# Altium schematic sheet 13_LMS3_Power.SchDoc: LMS7002M power supply (LMS3)
size A3; Organization: Lime Microsystems; Address1: Surrey Tech Centre; Address2: Guildford GU2 7YG; Address3: Surrey; Address4: United Kingdom; SheetNumber: 10
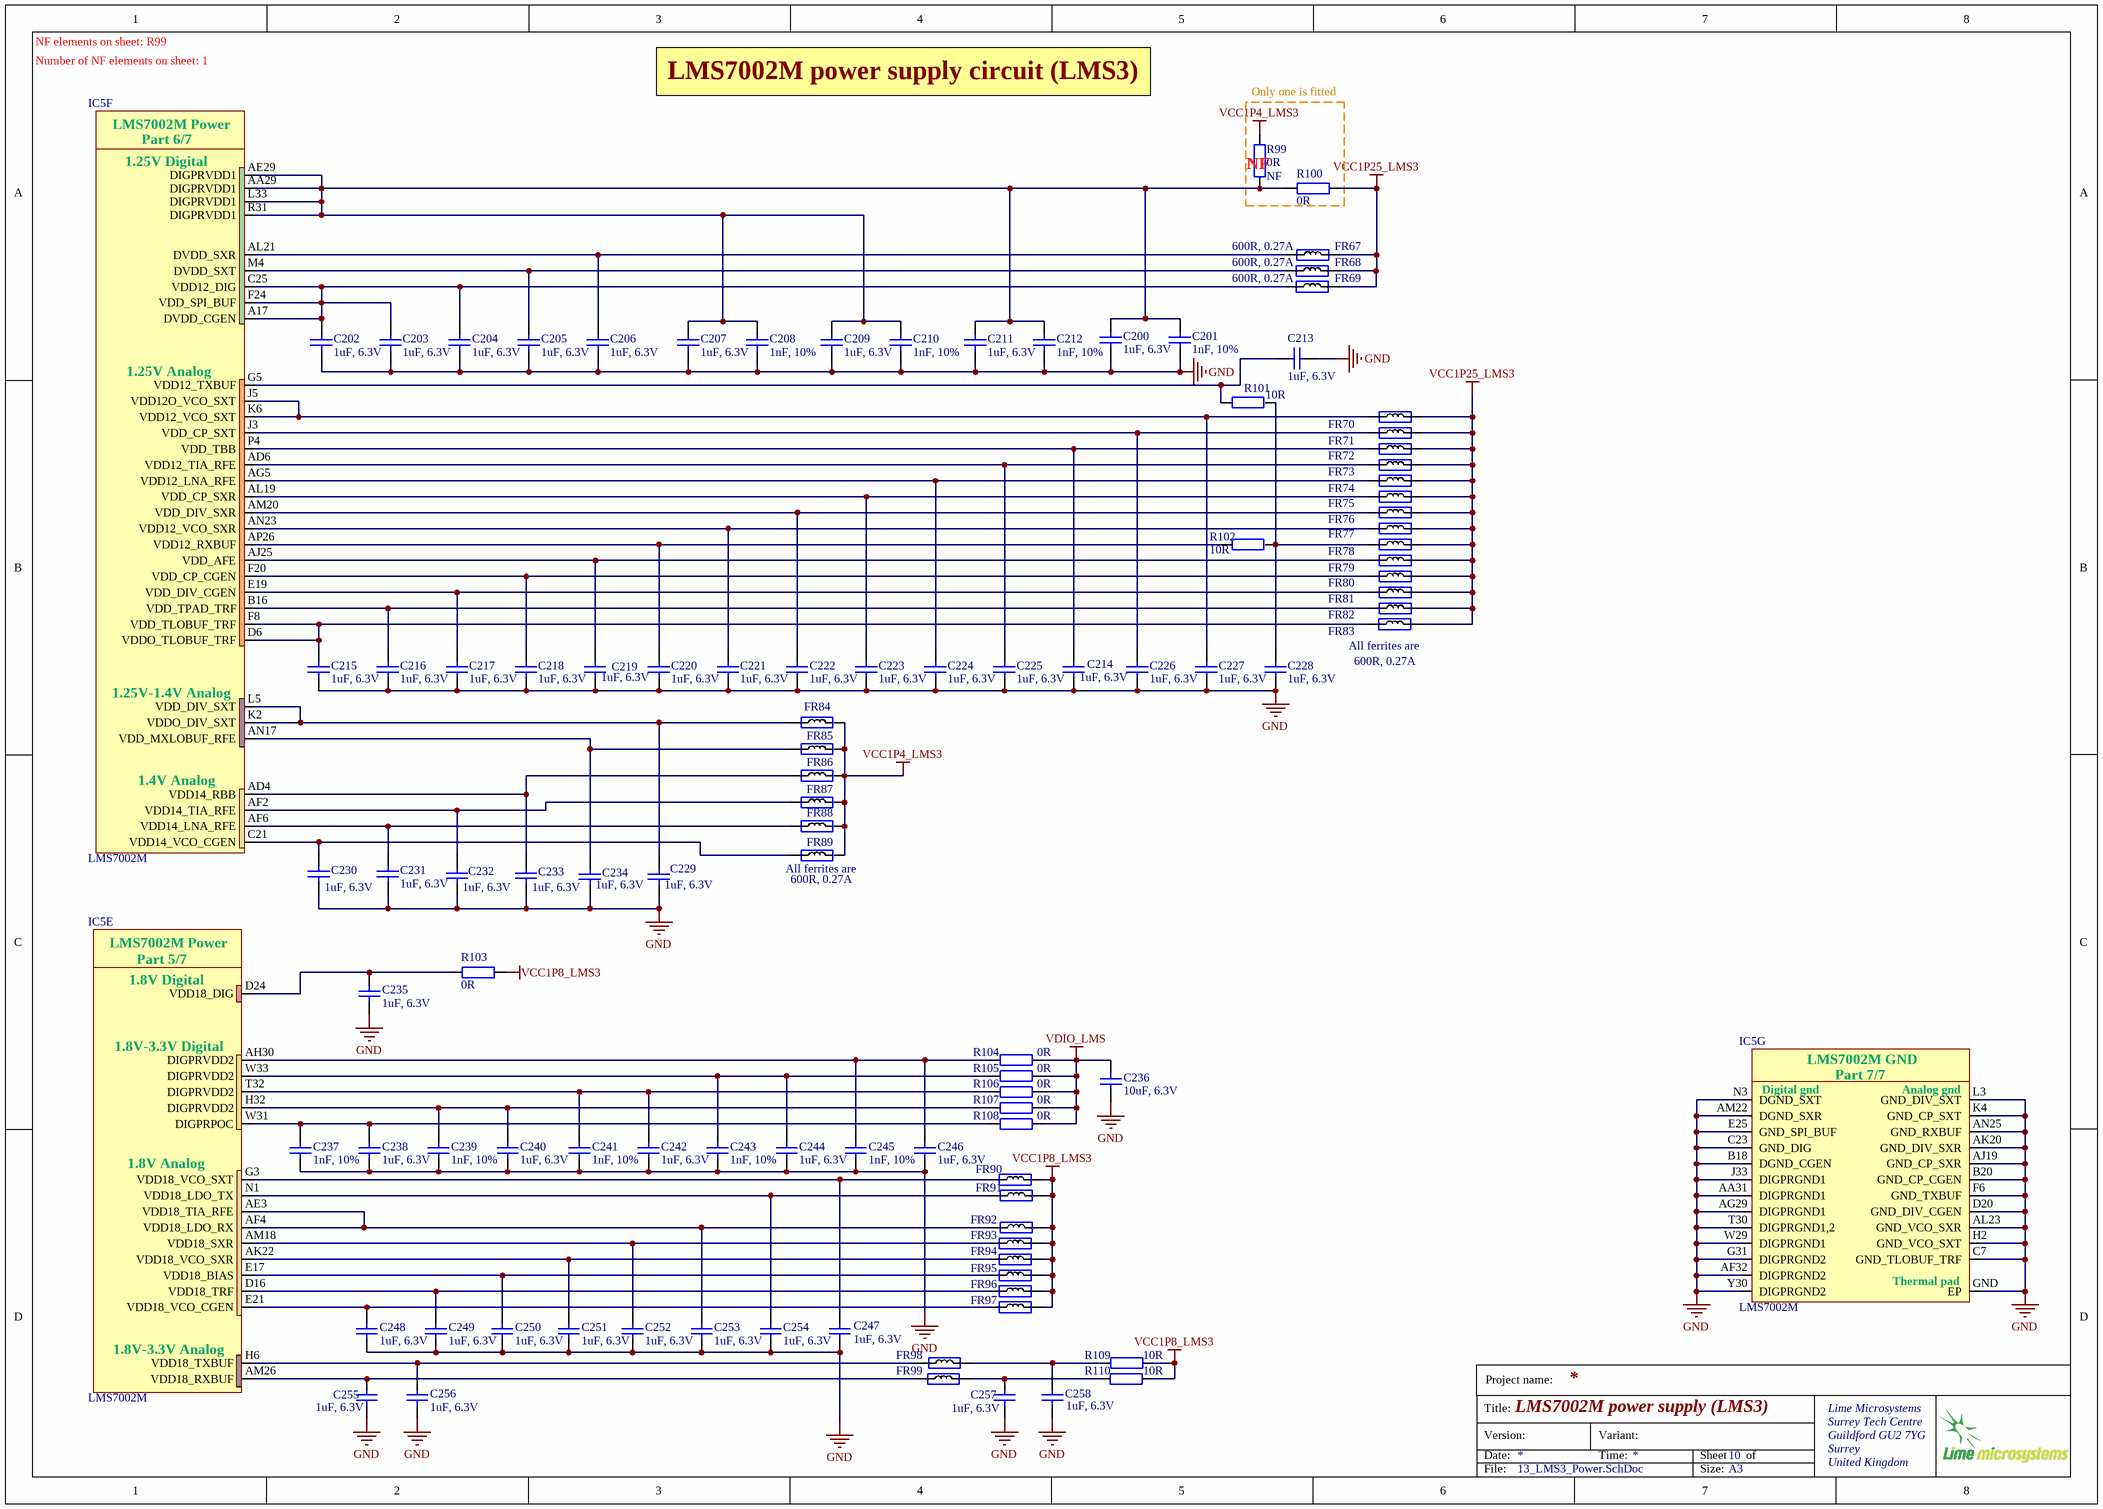
[diagram p0: 13_LMS3_Power.SchDoc]

## Parts
C200  1uF, 6.3V  [CAP0201]
C201  1nF, 10%  [CAP0201]
C202  1uF, 6.3V  [CAP0201]
C203  1uF, 6.3V  [CAP0201]
C204  1uF, 6.3V  [CAP0201]
C205  1uF, 6.3V  [CAP0201]
C206  1uF, 6.3V  [CAP0201]
C207  1uF, 6.3V  [CAP0201]
C208  1nF, 10%  [CAP0201]
C209  1uF, 6.3V  [CAP0201]
C210  1nF, 10%  [CAP0201]
C211  1uF, 6.3V  [CAP0201]
C212  1nF, 10%  [CAP0201]
C213  1uF, 6.3V  [CAP0201]
C214  1uF, 6.3V  [CAP0201]
C215  1uF, 6.3V  [CAP0201]
C216  1uF, 6.3V  [CAP0201]
C217  1uF, 6.3V  [CAP0201]
C218  1uF, 6.3V  [CAP0201]
C219  1uF, 6.3V  [CAP0201]
C220  1uF, 6.3V  [CAP0201]
C221  1uF, 6.3V  [CAP0201]
C222  1uF, 6.3V  [CAP0201]
C223  1uF, 6.3V  [CAP0201]
C224  1uF, 6.3V  [CAP0201]
C225  1uF, 6.3V  [CAP0201]
C226  1uF, 6.3V  [CAP0201]
C227  1uF, 6.3V  [CAP0201]
C228  1uF, 6.3V  [CAP0201]
C229  1uF, 6.3V  [CAP0201]
C230  1uF, 6.3V  [CAP0201]
C231  1uF, 6.3V  [CAP0201]
C232  1uF, 6.3V  [CAP0201]
C233  1uF, 6.3V  [CAP0201]
C234  1uF, 6.3V  [CAP0201]
C235  1uF, 6.3V  [CAP0201]
C236  10uF, 6.3V  [CAP0603]
C237  1nF, 10%  [CAP0201]
C238  1uF, 6.3V  [CAP0201]
C239  1nF, 10%  [CAP0201]
C240  1uF, 6.3V  [CAP0201]
C241  1nF, 10%  [CAP0201]
C242  1uF, 6.3V  [CAP0201]
C243  1nF, 10%  [CAP0201]
C244  1uF, 6.3V  [CAP0201]
C245  1nF, 10%  [CAP0201]
C246  1uF, 6.3V  [CAP0201]
C247  1uF, 6.3V  [CAP0201]
C248  1uF, 6.3V  [CAP0201]
C249  1uF, 6.3V  [CAP0201]
C250  1uF, 6.3V  [CAP0201]
C251  1uF, 6.3V  [CAP0201]
C252  1uF, 6.3V  [CAP0201]
C253  1uF, 6.3V  [CAP0201]
C254  1uF, 6.3V  [CAP0201]
C255  1uF, 6.3V  [CAP0201]
C256  1uF, 6.3V  [CAP0201]
C257  1uF, 6.3V  [CAP0201]
C258  1uF, 6.3V  [CAP0201]
FR67  600R, 0.27A  [RES0201]
FR68  600R, 0.27A  [RES0201]
FR69  600R, 0.27A  [RES0201]
FR70  600R, 0.27A  [RES0201]  (value not drawn)
FR71  600R, 0.27A  [RES0201]  (value not drawn)
FR72  600R, 0.27A  [RES0201]  (value not drawn)
FR73  600R, 0.27A  [RES0201]  (value not drawn)
FR74  600R, 0.27A  [RES0201]  (value not drawn)
FR75  600R, 0.27A  [RES0201]  (value not drawn)
FR76  600R, 0.27A  [RES0201]  (value not drawn)
FR77  600R, 0.27A  [RES0201]  (value not drawn)
FR78  600R, 0.27A  [RES0201]  (value not drawn)
FR79  600R, 0.27A  [RES0201]  (value not drawn)
FR80  600R, 0.27A  [RES0201]  (value not drawn)
FR81  600R, 0.27A  [RES0201]  (value not drawn)
FR82  600R, 0.27A  [RES0201]  (value not drawn)
FR83  600R, 0.27A  [RES0201]  (value not drawn)
FR84  600R, 0.27A  [RES0201]  (value not drawn)
FR85  600R, 0.27A  [RES0201]  (value not drawn)
FR86  600R, 0.27A  [RES0201]  (value not drawn)
FR87  600R, 0.27A  [RES0201]  (value not drawn)
FR88  600R, 0.27A  [RES0201]  (value not drawn)
FR89  600R, 0.27A  [RES0201]  (value not drawn)
FR90  600R, 0.27A  [RES0201]  (value not drawn)
FR91  600R, 0.27A  [RES0201]  (value not drawn)
FR92  600R, 0.27A  [RES0201]  (value not drawn)
FR93  600R, 0.27A  [RES0201]  (value not drawn)
FR94  600R, 0.27A  [RES0201]  (value not drawn)
FR95  600R, 0.27A  [RES0201]  (value not drawn)
FR96  600R, 0.27A  [RES0201]  (value not drawn)
FR97  600R, 0.27A  [RES0201]  (value not drawn)
FR98  600R, 0.27A  [RES0201]  (value not drawn)
FR99  600R, 0.27A  [RES0201]  (value not drawn)
IC5  LMS7002M  [LMS7002M_v5]  (parts E,F,G of 7)
R99  0R  Assembly Info: NF  [RES0402]
R100  0R  [RES0402]
R101  10R  [RES0201]
R102  10R  [RES0201]
R103  0R  [RES0201]
R104  0R  [RES0402]
R105  0R  [RES0402]
R106  0R  [RES0402]
R107  0R  [RES0402]
R108  0R  [RES0402]
R109  10R  [RES0201]
R110  10R  [RES0201]

## Blocks framed on the sheet
Only one is fitted: R99 R100

## Nets
GND: C200.2 C201.2 C202.2 C203.2 C204.2 C205.1 C206.2 C207.2 C208.2 C209.2 C210.2 C211.2 C212.2 C213.2 C214.2 C215.2 C216.2 C217.2 C218.1 C219.2 C220.2 C221.2 C222.2 C223.2 C224.2 C225.1 C226.2 C227.1 C228.1 C229.2 C230.2 C231.2 C232.2 C233.2 C234.2 C235.2 C236.1 C237.2 C238.2 C239.2 C240.2 C241.2 C242.2 C243.2 C244.2 C245.2 C246.2 C247.2 C248.2 C249.2 C250.2 C251.2 C252.2 C253.2 C254.2 C255.2 C256.2 C257.2 C258.2 IC5.AA31(DIGPRGND1) IC5.AF32(DIGPRGND2) IC5.AG29(DIGPRGND1) IC5.AJ19(GND_CP_SXR) IC5.AK20(GND_DIV_SXR) IC5.AL23(GND_VCO_SXR) IC5.AM22(DGND_SXR) IC5.AN25(GND_RXBUF) IC5.B18(DGND_CGEN) IC5.B20(GND_CP_CGEN) IC5.C7(GND_TLOBUF_TRF) IC5.C23(GND_DIG) IC5.D20(GND_DIV_CGEN) IC5.E25(GND_SPI_BUF) IC5.F6(GND_TXBUF) IC5.G31(DIGPRGND2) IC5.GND(EP) IC5.H2(GND_VCO_SXT) IC5.J33(DIGPRGND1) IC5.K4(GND_CP_SXT) IC5.L3(GND_DIV_SXT) IC5.N3(DGND_SXT) IC5.T30(DIGPRGND1,2) IC5.W29(DIGPRGND1) IC5.Y30(DIGPRGND2)
VCC1P4_LMS3: FR84.2 FR85.2 FR86.2 FR87.2 FR88.2 FR89.2 R99.1
VCC1P8_LMS3: FR90.2 FR91.1 FR92.1 FR93.2 FR94.2 FR95.2 FR96.2 FR97.2 R103.2 R109.2 R110.1
VCC1P25_LMS3: FR67.2 FR68.2 FR69.2 FR70.2 FR71.2 FR72.2 FR73.2 FR74.2 FR75.2 FR76.2 FR77.2 FR78.2 FR79.2 FR80.2 FR81.2 FR82.2 FR83.2 R100.1
VDIO_LMS: C236.2 R104.1 R105.1 R106.1 R107.1 R108.1
NetC200_1: C200.1 C201.1 C207.1 C208.1 C209.1 C210.1 C211.1 C212.1 IC5.AA29(DIGPRVDD1) IC5.AE29(DIGPRVDD1) IC5.L33(DIGPRVDD1) IC5.R31(DIGPRVDD1) R99.2 R100.2
NetC202_1: C202.1 C203.1 C204.1 FR69.1 IC5.A17(DVDD_CGEN) IC5.C25(VDD12_DIG) IC5.F24(VDD_SPI_BUF)
NetC205_2: C205.2 FR68.1 IC5.M4(DVDD_SXT)
NetC206_1: C206.1 FR67.1 IC5.AL21(DVDD_SXR)
NetC213_1: C213.1 IC5.G5(VDD12_TXBUF) R101.1
NetC214_1: C214.1 FR72.1 IC5.P4(VDD_TBB)
NetC215_1: C215.1 FR83.1 IC5.D6(VDDO_TLOBUF_TRF) IC5.F8(VDD_TLOBUF_TRF)
NetC216_1: C216.1 FR82.1 IC5.B16(VDD_TPAD_TRF)
NetC217_1: C217.1 FR81.1 IC5.E19(VDD_DIV_CGEN)
NetC218_2: C218.2 FR80.1 IC5.F20(VDD_CP_CGEN)
NetC219_1: C219.1 FR79.1 IC5.AJ25(VDD_AFE)
NetC220_1: C220.1 IC5.AP26(VDD12_RXBUF) R102.1
NetC221_1: C221.1 FR77.1 IC5.AN23(VDD12_VCO_SXR)
NetC222_1: C222.1 FR76.1 IC5.AM20(VDD_DIV_SXR)
NetC223_1: C223.1 FR75.1 IC5.AL19(VDD_CP_SXR)
NetC224_1: C224.1 FR74.1 IC5.AG5(VDD12_LNA_RFE)
NetC225_2: C225.2 FR73.1 IC5.AD6(VDD12_TIA_RFE)
NetC226_1: C226.1 FR71.1 IC5.J3(VDD_CP_SXT)
NetC227_2: C227.2 FR70.1 IC5.J5(VDD12O_VCO_SXT) IC5.K6(VDD12_VCO_SXT)
NetC228_2: C228.2 FR78.1 R101.2 R102.2
NetC229_1: C229.1 FR84.1 IC5.K2(VDDO_DIV_SXT) IC5.L5(VDD_DIV_SXT)
NetC230_1: C230.1 FR89.1 IC5.C21(VDD14_VCO_CGEN)
NetC231_1: C231.1 FR88.1 IC5.AF6(VDD14_LNA_RFE)
NetC232_1: C232.1 FR87.1 IC5.AF2(VDD14_TIA_RFE)
NetC233_1: C233.1 FR86.1 IC5.AD4(VDD14_RBB)
NetC234_1: C234.1 FR85.1 IC5.AN17(VDD_MXLOBUF_RFE)
NetC235_1: C235.1 IC5.D24(VDD18_DIG) R103.1
NetC237_1: C237.1 C238.1 IC5.W31(DIGPRPOC) R108.2
NetC239_1: C239.1 C240.1 IC5.H32(DIGPRVDD2) R107.2
NetC241_1: C241.1 C242.1 IC5.T32(DIGPRVDD2) R106.2
NetC243_1: C243.1 C244.1 IC5.W33(DIGPRVDD2) R105.2
NetC245_1: C245.1 C246.1 IC5.AH30(DIGPRVDD2) R104.2
NetC247_1: C247.1 FR90.1 IC5.G3(VDD18_VCO_SXT)
NetC248_1: C248.1 FR97.1 IC5.E21(VDD18_VCO_CGEN)
NetC249_1: C249.1 FR96.1 IC5.D16(VDD18_TRF)
NetC250_1: C250.1 FR95.1 IC5.E17(VDD18_BIAS)
NetC251_1: C251.1 FR94.1 IC5.AK22(VDD18_VCO_SXR)
NetC252_1: C252.1 FR93.1 IC5.AM18(VDD18_SXR)
NetC253_1: C253.1 FR92.2 IC5.AE3(VDD18_TIA_RFE) IC5.AF4(VDD18_LDO_RX)
NetC254_1: C254.1 FR91.2 IC5.N1(VDD18_LDO_TX)
NetC255_1: C255.1 FR99.1 IC5.AM26(VDD18_RXBUF)
NetC256_1: C256.1 FR98.2 IC5.H6(VDD18_TXBUF)
NetC257_1: C257.1 FR99.2 R110.2
NetC258_1: C258.1 FR98.1 R109.1

## Notes on the sheet
- NF elements on sheet: R99
- Number of NF elements on sheet: 1
- LMS7002M power supply circuit (LMS3)
- (near R99) NF
- (near FR83) All ferrites are
- 600R, 0.27A
- (near FR89) All ferrites are
- (near FR89) 600R, 0.27A
- Project name:
- Title:
- Version:
- Date:
- Variant:
- Time:
- Sheet
- of
- File:
- Size:
- A3
- (in symbol LMS7002Mr4, part E) LMS7002M Power; Part 5/7; 1.8V Digital; 1.8V-3.3V Digital; 1.8V Analog; 1.8V-3.3V Analog
- (in symbol LMS7002Mr4, part F) LMS7002M Power; Part 6/7; 1.25V Digital; 1.25V Analog; 1.25V-1.4V Analog; 1.4V Analog
- (in symbol LMS7002Mr4, part G) LMS7002M GND; Part 7/7; Digital gnd; Analog gnd; Thermal pad

## Library data of the parts
C200 C202-C207 C209 C211 C213-C235 C238 C240 C242 C244 C246-C258 = Cap_0402: Manufacturer: TDK Corporation; Manufacturer Part Number 1: JMK063ABJ105MP-F; Part Description: 1µF ±20% 6.3V X5R Ceramic Capacitor -55°C ~ 85°C Surface Mount, MLCC 0201 (0603 Metric) 0.024" L x 0.012" W (0.60mm x 0.30mm); Value: 1uF, 20%; Tolerance: ±20%; Capacitance: 1.0µF; Temperature Coefficient: X5R; Supplier 1: Digi-Key; Supplier Part Number 1: 587-5864-2-ND; Applications: General Purpose; Features: -; Lead Style: -; Ratings: -; Thickness (Max): -; Lead Spacing: -; Height - Seated (Max): -; Size / Dimension: 0.024" L x 0.012" W (0.60mm x 0.30mm); Mounting Type: Surface Mount, MLCC; Operating Temperature: -55°C ~ 85°C; Package / Case: 0201 (0603 Metric); Packaging: Cut Tape (CT); Voltage - Rated: 6.3V; Category: Capacitors; RoHS: RoHS Compliant
C201 C208 C210 C212 C237 C239 C241 C243 C245 = Cap_0402: Manufacturer Part Number 1: C0603X7R1E102K030BA; Manufacturer: TDK Corporation; Part Description: 1000pF ±10% 25V X7R Ceramic Capacitor -55°C ~ 125°C Surface Mount, MLCC 0201 (0603 Metric) 0.024" L x 0.012" W (0.60mm x 0.30mm); Voltage - Rated: 25V; Temperature Coefficient: X7R; Capacitance: 1000pF; Value: 1nF, 10%; Supplier 1: Digi-Key; Supplier Part Number 1: 445-7275-1-ND; Features: -; Package / Case: 0201 (0603 Metric); Lead Spacing: -; Mounting Type: Surface Mount, MLCC; Lead Style: -; Height - Seated (Max): -; Operating Temperature: -55°C ~ 125°C; Tolerance: ±10%; Size / Dimension: 0.024" L x 0.012" W (0.60mm x 0.30mm); Applications: General Purpose; Ratings: -; Thickness (Max): 0.013" (0.33mm); RoHS: RoHS Compliant; Packaging: Cut Tape (CT); Category: Capacitors
C236 = Cap_0603: Manufacturer Part Number 1: CC0603MRX5R5BB106; Manufacturer: Yageo; Part Description: 10µF ±20% 6.3V X5R Ceramic Capacitor -55°C ~ 85°C Surface Mount, MLCC 0603 (1608 Metric) 0.063" L x 0.031" W (1.60mm x 0.80mm); Capacitance: 10µF; Tolerance: ±20%; Supplier 1: Digi-Key; Supplier Part Number 1: 311-1448-2-ND; Package / Case: 0603 (1608 Metric); Category: Capacitors; Voltage - Rated: 6.3V; Value: 10uF, 6.3V
FR67-FR99 = Ferrite: Manufacturer Part Number 1: BK0603TS601-T; Manufacturer: Taiyo Yuden; Part Description: FERRITE BEAD 600 OHM 0201 1LN; DC Resistance (DCR): 750 mOhm Max; Filter Type: Differential Mode - Single; Impedance @ Frequency: 600 Ohm @ 100MHz; Current Rating: 270mA; Value: 600R@100MHz; Supplier 1: Digi-Key; Supplier Part Number 1: 587-3277-1-ND; Size / Dimension: 0.024" L x 0.012" W (0.60mm x 0.30mm); Package / Case: 0201 (0603 Metric); Height (Max): 0.013" (0.33mm); Mounting Type: Surface Mount; Packaging: Cut Tape (CT); RoHS: RoHS Compliant; Category: Filters
IC5 = LMS7002Mr4: Schematic symbol revision 4. Default footprint - 0.31mm pad; Manufacturer: Lime Microsystems; Part Description: IC FPRF Transceiver LMS7002M; 261 pin aQFN; Supplier 1: Lime Microsystems; Supplier Part Number 1: LMS7002M; Manufacturer Part Number 1: LMS7002M
R99 R100 R104-R108 = Res_0402: Manufacturer Part Number 1: RC0402JR-070RL; Manufacturer: Yageo; Part Description: RES SMD 0.0OHM JUMPER 1/16W 0402; Resistance (Ohms): 0.0; Tolerance: Jumper; Power (Watts): 0.063W, 1/16W; Value: 0R; Supplier 1: Digi-Key; Supplier Part Number 1: 311-0.0JRTR-ND; Category: Resistors; Temperature Coefficient: -; Features: Moisture Resistant; Supplier Device Package: 0402; Height: 0.016" (0.40mm); Package / Case: 0402 (1005 Metric); Operating Temperature: -55°C ~ 155°C; Size / Dimension: 0.039" L x 0.020" W (1.00mm x 0.50mm); Composition: Thick Film; Packaging: Tape & Reel (TR); Number of Terminations: 2; RoHS: RoHS Compliant
R101 R102 R109 R110 = Res_0402: Manufacturer: Panasonic Electronic Components; Part Description: RES SMD 10 OHM 1% 1/20W 0201; Manufacturer Part Number 1: ERJ-1GEF10R0C; Power (Watts): 0.05W, 1/20W; Resistance (Ohms): 10; Tolerance: ±1%; Temperature Coefficient: ±200ppm/°C; Value: 10R; Supplier 1: Digi-Key; Supplier Part Number 1: P10.0ABCT-ND; Package / Case: 0201 (0603 Metric); Height: 0.010" (0.26mm); Supplier Device Package: 0201; Packaging: Cut Tape (CT); Composition: Thick Film; Category: Resistors; Number of Terminations: 2; Size / Dimension: 0.024" L x 0.012" W (0.60mm x 0.30mm); Operating Temperature: -55°C ~ 125°C; Features: -; RoHS: RoHS Compliant
R103 = Res_0402: Manufacturer Part Number 1: RC0201FR-070RL; Manufacturer: Rohm Semiconductor; Part Description: RES SMD 0.0OHM JUMPER 1/20W 0201; Resistance (Ohms): 0.0; Power (Watts): 0.05W, 1/20W; Tolerance: Jumper; Value: 0R; Supplier 1: Digi-Key; Supplier Part Number 1: 311-0.0MCT-ND; Number of Terminations: 2; Operating Temperature: -55°C ~ 125°C; Package / Case: 0201 (0603 Metric); Height: 0.010" (0.26mm); Supplier Device Package: 0201 (0603 Metric); Size / Dimension: 0.024" L x 0.012" W (0.60mm x 0.30mm); Temperature Coefficient: -; Category: Resistors; Features: -; RoHS: RoHS Compliant; Composition: Thick Film; Packaging: Cut Tape (CT)